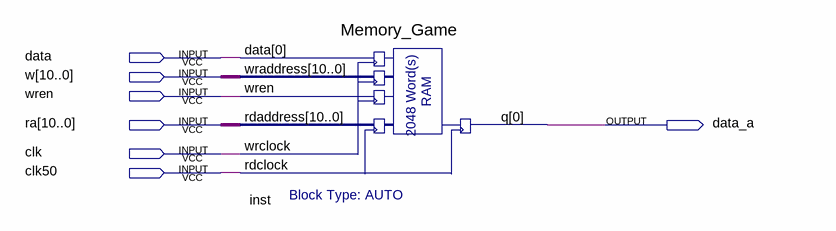
[diagram p0: schematic sheet]
// Quartus schematic memory.bdf as structural Verilog: 1 symbols, 7 pins
module memory (
  input  data,
  input  [10:0] w,
  input  wren,
  input  [10:0] ra,
  input  clk,
  input  clk50,
  output data_a
);

  Memory_Game inst (
    .data(data), .wraddress(w), .wren(wren), .rdaddress(ra), .wrclock(clk), .rdclock(clk50), .q(data_a));
endmodule
